# Altium schematic sheet System Control - Serial Flash.SchDoc
size B
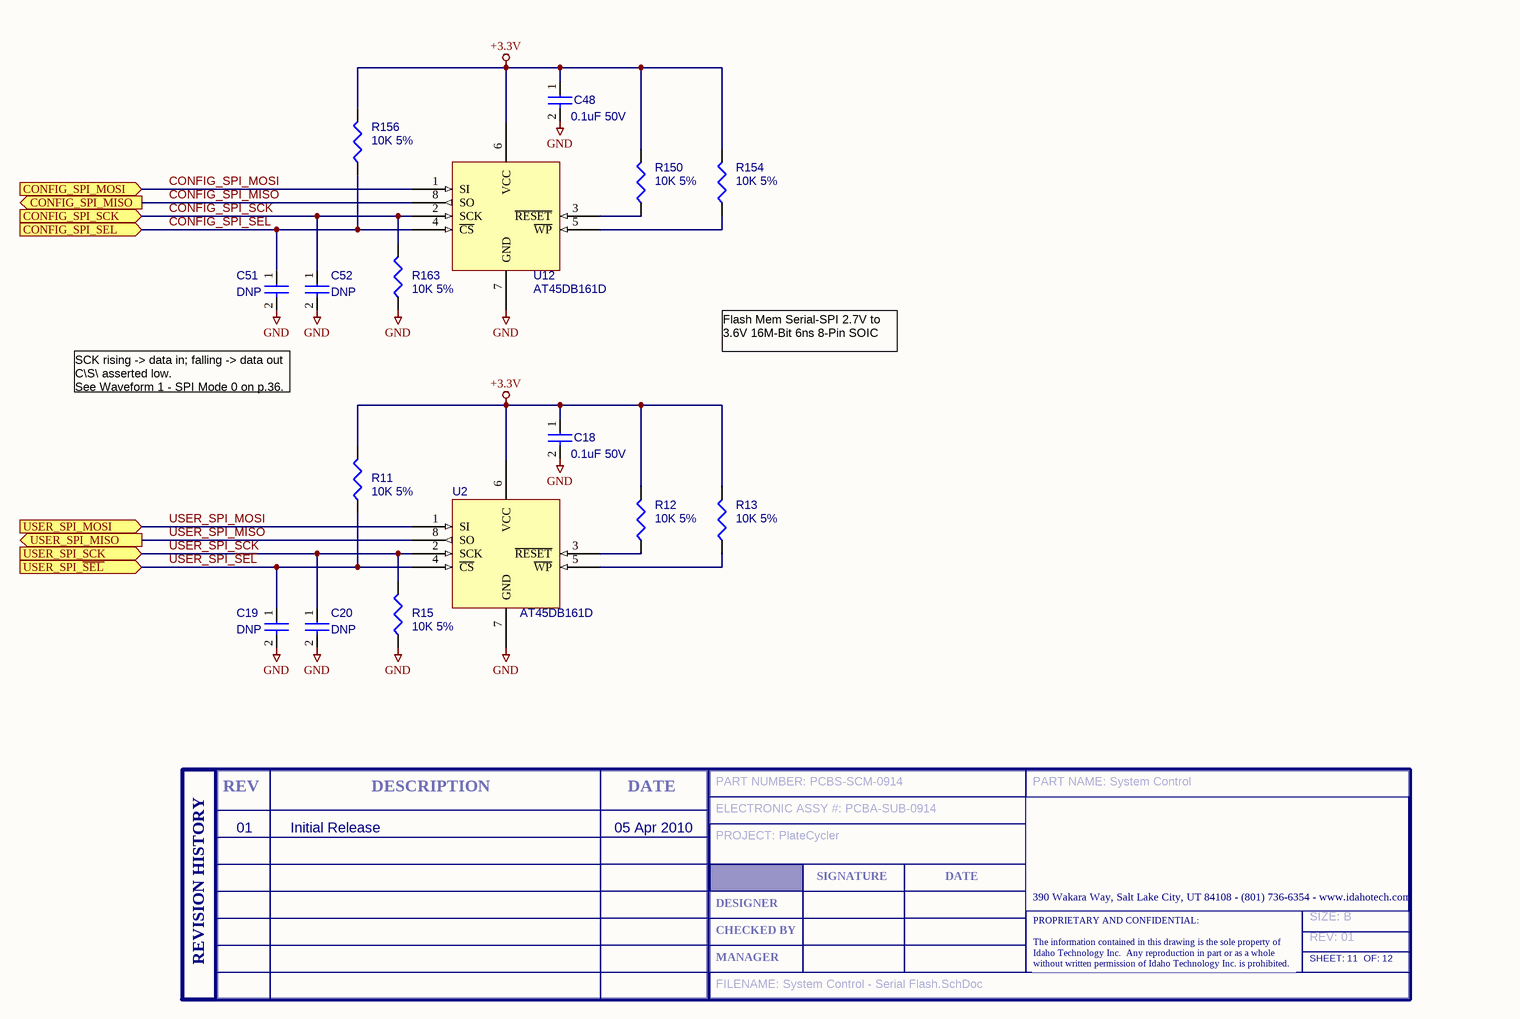
[diagram p0: System Control - Serial Flash.SchDoc]

## Parts
C18  0.1uF 50V  [SM/C_0603]
C19  DNP  [SM/C_0603]  (no BOM)
C20  DNP  [SM/C_0603]  (no BOM)
C48  0.1uF 50V  [SM/C_0603]
C51  DNP  [SM/C_0603]  (no BOM)
C52  DNP  [SM/C_0603]  (no BOM)
R11  10K 5%  [SM/R_0603]
R12  10K 5%  [SM/R_0603]
R13  10K 5%  [SM/R_0603]
R15  10K 5%  [SM/R_0603]
R150  10K 5%  [SM/R_0603]
R154  10K 5%  [SM/R_0603]
R156  10K 5%  [SM/R_0603]
R163  10K 5%  [SM/R_0603]
T?  SIZE: B  REV: 01  FILENAME: System Control - Serial Flash.SchDoc  PART NUMBER: PCBS-SCM-0914  PART NAME: System Control  ELECTRONIC ASSY #: PCBA-SUB-0914  PROJECT: PlateCycler  SHEET: 11  OF: 12  (hidden comment: ITI Title Block, A Size)  (graphical)
U2  AT45DB161D  [8S2_M]
U12  AT45DB161D  [8S2_M]

## Ports
CONFIG_SPI_MISO (out), CONFIG_SPI_MOSI (in), CONFIG_SPI_SCK (in), CONFIG_SPI_SEL (in), USER_SPI_MISO (out), USER_SPI_MOSI (in), USER_SPI_SCK (in), USER_SPI_~{SEL} (in)

## Nets
+3.3V: C18.1 C48.1 R11.2 R12.2 R13.2 R150.2 R154.2 R156.2 U2.6(VCC) U12.6(VCC)
GND: C18.2 C19.2 C20.2 C48.2 C51.2 C52.2 R15.1 R163.1 U2.7(GND) U12.7(GND)
CONFIG_SPI_MISO: U12.8(SO) ; port CONFIG_SPI_MISO
CONFIG_SPI_MOSI: U12.1(SI) ; port CONFIG_SPI_MOSI
CONFIG_SPI_SCK: C52.1 R163.2 U12.2(SCK) ; port CONFIG_SPI_SCK
CONFIG_SPI_SEL: C51.1 R156.1 U12.4(~{CS}) ; port CONFIG_SPI_SEL
USER_SPI_MISO: U2.8(SO) ; port USER_SPI_MISO
USER_SPI_MOSI: U2.1(SI) ; port USER_SPI_MOSI
USER_SPI_~{SEL}: C19.1 R11.1 U2.4(~{CS}) ; port USER_SPI_~{SEL}
USER_SPI_SCK: C20.1 R15.2 U2.2(SCK) ; port USER_SPI_SCK
NetR12_1: R12.1 U2.3(~{RESET})
NetR13_1: R13.1 U2.5(~{WP})
NetR150_1: R150.1 U12.3(~{RESET})
NetR154_1: R154.1 U12.5(~{WP})

## Notes on the sheet
- Flash Mem Serial-SPI 2.7V to 3.6V 16M-Bit 6ns 8-Pin SOIC
- SCK rising -> data in; falling -> data out
  C\S\ asserted low.
  See Waveform 1 - SPI Mode 0 on p.36.
- 01
- Initial Release
- 05 Apr 2010
- (in symbol ITI A-size Title Block and Rev Table) REV; DESCRIPTION; DATE; SIGNATURE; 390 Wakara Way, Salt Lake City, UT 84108 - (801) 736-6354 - www.idahotech.com; DESIGNER; CHECKED BY; REVISION HISTORY; MANAGER; PROPRIETARY AND CONFIDENTIAL: / The information contained in this drawing is the sole property of / Idaho Technology Inc.  Any reproduction in part or as a whole / without written permission of Idaho Technology Inc. is prohibited.

## Library data of the parts
C18-C20 C48 C51 C52 = CAP NP_1: CAP CER .10UF 50V X7R 0603; Manufacturer P/N: UMK107B7104KA-T; Manufacturer: Taiyo Yuden; Vendor P/N: 587-1243-1-ND; Vendor: Digikey
R11-R13 R15 R150 R154 R156 R163 = R10K 5% 0603: RES 10K OHM 1/10W 5% 0603 SMD; Manufacturer: Panasonic; Manufacturer P/N: ERJ-3GEYJ103V; Vendor: Digikey; Vendor P/N: P10KGCT-ND
T? = ITI A-size Title Block and Rev Table: ITI Title Block and Rev Table, A Size
U2 U12 = AT45DB161D: Flash Mem Serial-SPI 2.7V to 3.6V 16M-Bit 6ns 8-Pin SOIC; Manufacturer P/N: AT45DB161D-SU; Manufacturer: Atmel; Vendor: Digikey; Vendor P/N: AT45DB161D-SU-ND